# EAGLE design Breakout1v1 (EAGLE 9.0.1)
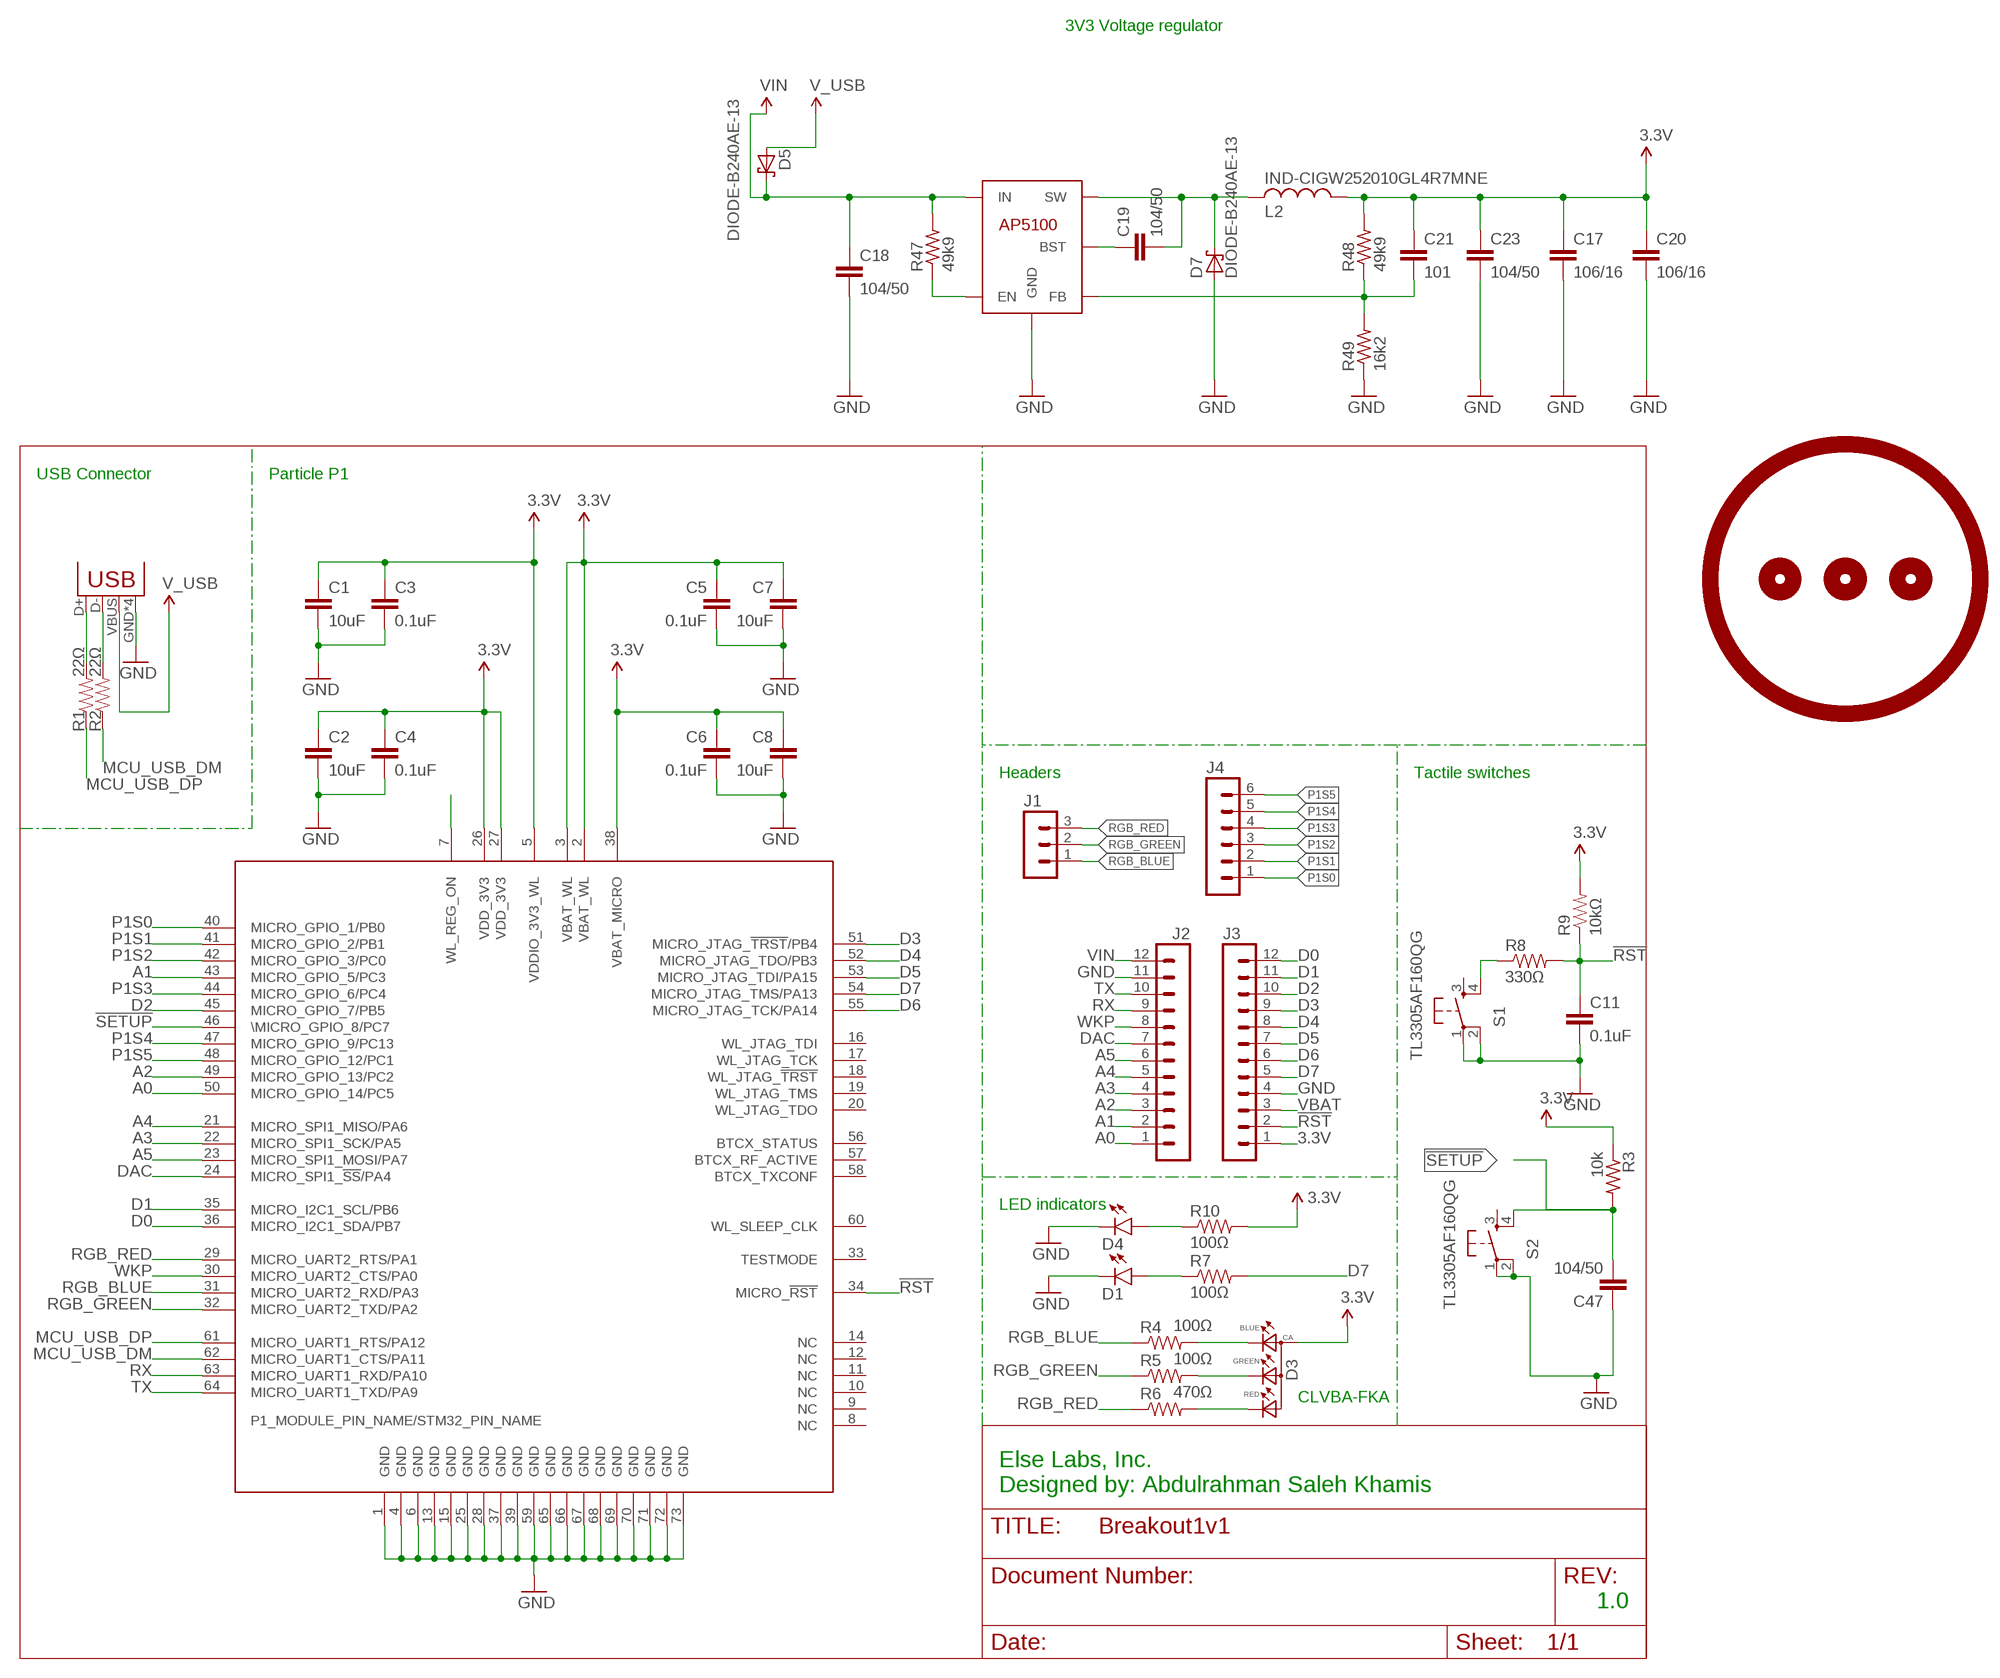
[diagram p0: schematic, sheet 1]

## Parts
C1  10uF  CAP0805  [0805]
C2  10uF  CAP0805  [0805]
C3  0.1uF  CAP0805  [0805]
C4  0.1uF  CAP0805  [0805]
C5  0.1uF  CAP0805  [0805]
C6  0.1uF  CAP0805  [0805]
C7  10uF  CAP0805  [0805]
C8  10uF  CAP0805  [0805]
C11  0.1uF  CAP0805  [0805]
C17  106/16  C-EUC0805  [C0805]
C18  104/50  C-EUC0603  [C0603]
C19  104/50  C-EUC0603  [C0603]
C20  106/16  C-EUC0805  [C0805]
C21  101  C-EUC0603  [C0603]
C23  104/50  C-EUC0603  [C0603]
C47  104/50  C-EUC0603  [C0603]
D1  LED0603  [LED-0603]
D3  CLVBA-FKAPLCC  [4-PLCC]
D4  LED0603  [LED-0603]
D5  DIODE-B240AE-13  [DO-214AC]
D7  DIODE-B240AE-13  [DO-214AC]
IC5  SMSP-BUCK-AP5100  [SOT23-6]
J1  MA03-1  [MA03-1]
J2  MA12-1  [MA12-1]
J3  MA12-1  [MA12-1]
J4  MA06-1  [MA06-1]
JP1  USBUSB-MICROB-SLOT-HOLE  [USB-MICROB-SLOT-HOLE]
L2  IND-CIGW252010GL4R7MNE  [L2520]
R1  22Ω  RESISTOR0805-RES  [0805]
R2  22Ω  RESISTOR0805-RES  [0805]
R3  10k  R-US_R0603  [R0603]
R4  100Ω  RESISTOR0805-RES  [0805]
R5  100Ω  RESISTOR0805-RES  [0805]
R6  470Ω  RESISTOR0805-RES  [0805]
R7  100Ω  RESISTOR0805-RES  [0805]
R8  330Ω  RESISTOR0805-RES  [0805]
R9  10kΩ  RESISTOR0805-RES  [0805]
R10  100Ω  RESISTOR0805-RES  [0805]
R47  49k9  R-US_R0603  [R0603]
R48  49k9  R-US_R0603  [R0603]
R49  16k2  R-US_R0603  [R0603]
S1  TL3305AF160QG  SWITCH-MOMENTARY-4.5MX4.5M  [TACTILE_SWITCH_SMD_4.5X4.5MM]
S2  TL3305AF160QG  SWITCH-MOMENTARY-4.5MX4.5M  [TACTILE_SWITCH_SMD_4.5X4.5MM]
U$1  LOGO  [LOGO]
UC1  P1  [WM-N-BM-14]

## Nets
3.3V: C1.1 C2.1 C3.1 C4.1 C5.1 C6.1 C7.1 C8.1 C17.1 C20.1 C21.1 C23.1 D3.2(ANODE) J3.1 L2.P$1 R3.1 R9.2 R10.2 R48.2 UC1.2(VBAT_WL) UC1.3(VBAT_WL) UC1.5(VDDIO_3V3_WL) UC1.26(VDD_3V3) UC1.27(VDD_3V3) UC1.38(VBAT_MICRO)
!RST: C11.1 J3.2 R8.2 R9.1 UC1.34(MICRO_!RST!)
!SETUP: C47.2 R3.2 S2.4 UC1.46(\MICRO_GPIO_8/PC7)
A0: J2.1 UC1.50(MICRO_GPIO_14/PC5)
A1: J2.2 UC1.43(MICRO_GPIO_5/PC3)
A2: J2.3 UC1.49(MICRO_GPIO_13/PC2)
A3: J2.4 UC1.22(MICRO_SPI1_SCK/PA5)
A4: J2.5 UC1.21(MICRO_SPI1_MISO/PA6)
A5: J2.6 UC1.23(MICRO_SPI1_MOSI/PA7)
BLR: D3.3(BLUE) R4.2
D0: J3.12 UC1.36(MICRO_I2C1_SDA/PB7)
D1: J3.11 UC1.35(MICRO_I2C1_SCL/PB6)
D2: J3.10 UC1.45(MICRO_GPIO_7/PB5)
D3: J3.9 UC1.51(MICRO_JTAG_!TRST!/PB4)
D4: J3.8 UC1.52(MICRO_JTAG_TDO/PB3)
D5: J3.7 UC1.53(MICRO_JTAG_TDI/PA15)
D6: J3.6 UC1.55(MICRO_JTAG_TCK/PA14)
D7: J3.5 R7.2 UC1.54(MICRO_JTAG_TMS/PA13)
DAC: J2.7 UC1.24(MICRO_SPI1_!SS!/PA4)
GND: C1.2 C2.2 C3.2 C4.2 C5.2 C6.2 C7.2 C8.2 C11.2 C17.2 C18.2 C20.2 C23.2 C47.1 D1.C D4.C D7.A IC5.2(GND) J2.11 J3.4 JP1.GND JP1.P$1(GND) JP1.P$2(GND) JP1.P$3(GND) R49.1 S1.1 S1.2 S2.1 S2.2 UC1.1(GND) UC1.4(GND) UC1.6(GND) UC1.13(GND) UC1.15(GND) UC1.25(GND) UC1.28(GND) UC1.37(GND) UC1.39(GND) UC1.59(GND) UC1.65(GND) UC1.66(GND) UC1.67(GND) UC1.68(GND) UC1.69(GND) UC1.70(GND) UC1.71(GND) UC1.72(GND) UC1.73(GND)
GRR: D3.4(GREEN) R5.2
MCU_USB_DM: R2.1 UC1.62(MICRO_UART1_CTS/PA11)
MCU_USB_DP: R1.1 UC1.61(MICRO_UART1_RTS/PA12)
N$2: JP1.D+ R1.2
N$3: JP1.D- R2.2
N$6: D1.A R7.1
N$7: R8.1 S1.4
N$9: D4.A R10.1
N$18: IC5.4(EN) R47.1
N$36: C19.1 IC5.1(BST)
N$37: C19.2 D7.C IC5.6(SW) L2.P$2
N$38: C21.2 IC5.3(FB) R48.1 R49.2
N$43: UC1.7(WL_REG_ON)
P1S0: J4.1 UC1.40(MICRO_GPIO_1/PB0)
P1S1: J4.2 UC1.41(MICRO_GPIO_2/PB1)
P1S2: J4.3 UC1.42(MICRO_GPIO_3/PC0)
P1S3: J4.4 UC1.44(MICRO_GPIO_6/PC4)
P1S4: J4.5 UC1.47(MICRO_GPIO_9/PC13)
P1S5: J4.6 UC1.48(MICRO_GPIO_12/PC1)
RER: D3.1(RED) R6.2
RGB_BLUE: J1.1 R4.1 UC1.31(MICRO_UART2_RXD/PA3)
RGB_GREEN: J1.2 R5.1 UC1.32(MICRO_UART2_TXD/PA2)
RGB_RED: J1.3 R6.1 UC1.29(MICRO_UART2_RTS/PA1)
RX: J2.9 UC1.63(MICRO_UART1_RXD/PA10)
TX: J2.10 UC1.64(MICRO_UART1_TXD/PA9)
V_USB: D5.A JP1.VBUS
VBAT: J3.3
VIN: C18.1 D5.C IC5.5(IN) J2.12 R47.2
WKP: J2.8 UC1.30(MICRO_UART2_CTS/PA0)
Unconnected: S1.3 S2.3 UC1.8(NC) UC1.9(NC) UC1.10(NC) UC1.11(NC) UC1.12(NC) UC1.14(NC) UC1.16(WL_JTAG_TDI) UC1.17(WL_JTAG_TCK) UC1.18(WL_JTAG_!TRST!) UC1.19(WL_JTAG_TMS) UC1.20(WL_JTAG_TDO) UC1.33(TESTMODE) UC1.56(BTCX_STATUS) UC1.57(BTCX_RF_ACTIVE) UC1.58(BTCX_TXCONF) UC1.60(WL_SLEEP_CLK)

## Notes on the sheet
- 3V3 Voltage regulator
- USB Connector | Particle P1
- Headers | Tactile switches
- LED indicators
- CLVBA-FKA
- Else Labs, Inc.
  Designed by: Abdulrahman Saleh Khamis
- 1.0

## Library data of the parts
C1-C8 C11 = SparkFun-Capacitors:CAP: Capacitor Standard 0603 ceramic capacitor, and 0.1" leaded capacitor.
C17-C21 C23 C47 = rcl:C-EU: CAPACITOR, European symbol; SPICEPREFIX: C
D1 D4 = SparkFun-LED:LED: LEDs Standard schematic elements and footprints for 5mm, 3mm, 1206, and 0603 sized LEDs. 5mm - Spark Fun Electronics SKU : COM-00529 (and others)
D3 = ElseLabs:CLVBA-FKA: Everlight Red/Green/Blue LED 67-23/R6GHBHC-B01/2T || 67-23/R6GHBH-B01 Size 3.2*2.8*1.9mm Mounting Type SMD Full-Color LED PLCC4 Emitting Color Red/Green/Blue (620-625/530-535/470-475 nm) Chip Material AlGaInP/InGaN/InGaN Luminous Intensity 57-112/225-450/36-72 mcd Viewing Angle 120 deg Lens Type-Color Water Clear Forward Voltage 2.0/3.5/3.5 V Forward Current 10 mA Maximum Forward Voltage 2.4/3.9/3.9 V Maximum Forward Current 25/25/25 mA Min-Max Operating Temperature -40C to +85C Factory Pack 2000 pcs-Reel RoHS ✓; PROD_ID: DIO-12986
D5 D7 = TAHI EagleCAD part library:DIODE-B240AE-13
IC5 = TAHI EagleCAD part library:SMSP-BUCK-AP5100
J1 = con-lstb:MA03-1: PIN HEADER; OC_FARNELL: unknown; OC_NEWARK: unknown
J2 J3 = con-lstb:MA12-1: PIN HEADER; OC_FARNELL: unknown; OC_NEWARK: unknown
J4 = con-lstb:MA06-1: PIN HEADER; OC_FARNELL: unknown; OC_NEWARK: unknown
JP1 = ElseLabs:USB
L2 = TAHI EagleCAD part library:IND-CIGW252010GL4R7MNE
R1 R2 R4-R10 = SparkFun-Resistors:RESISTOR: Resistor Basic schematic elements and footprints for 0603, 1206, and PTH resistors.
R3 R47-R49 = rcl:R-US_: RESISTOR, American symbol; SPICEPREFIX: R
S1 S2 = ElseLabs:SWITCH-MOMENTARY
U$1 = ElseLabs:LOGO
UC1 = Particle-Devices:P1: Particle P1 module (WiFi with antenna)

## Net classes
1 P1: width 0.254 mm, drill 0.35 mm, clearance 0.178 mm

## Board
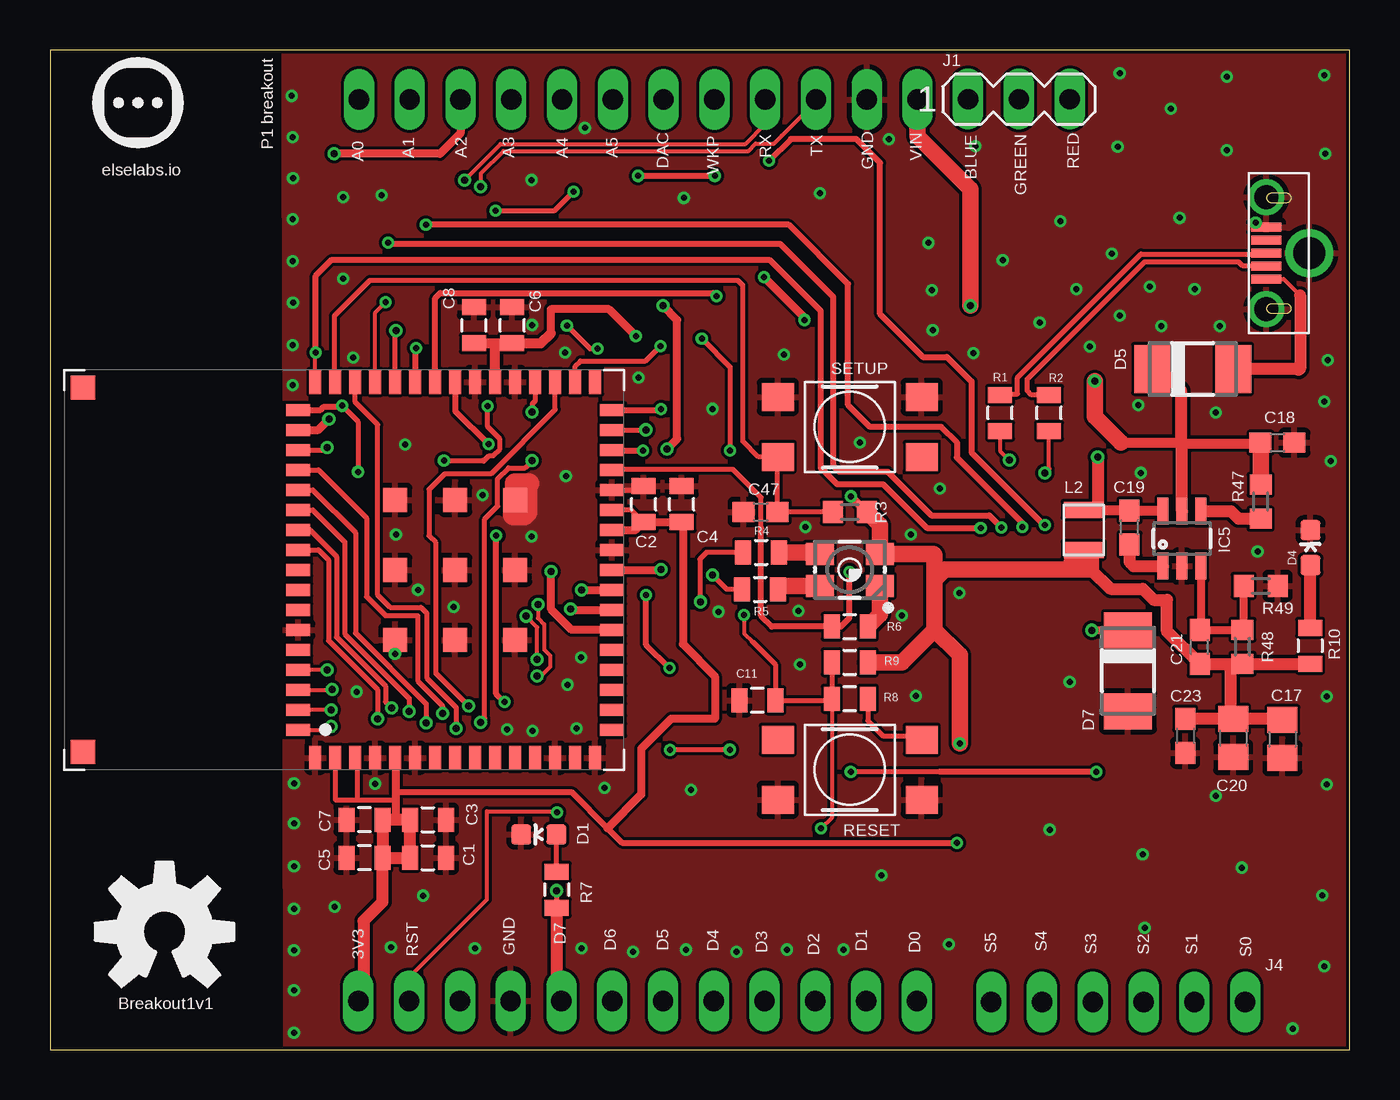
[diagram p1: board, top side]
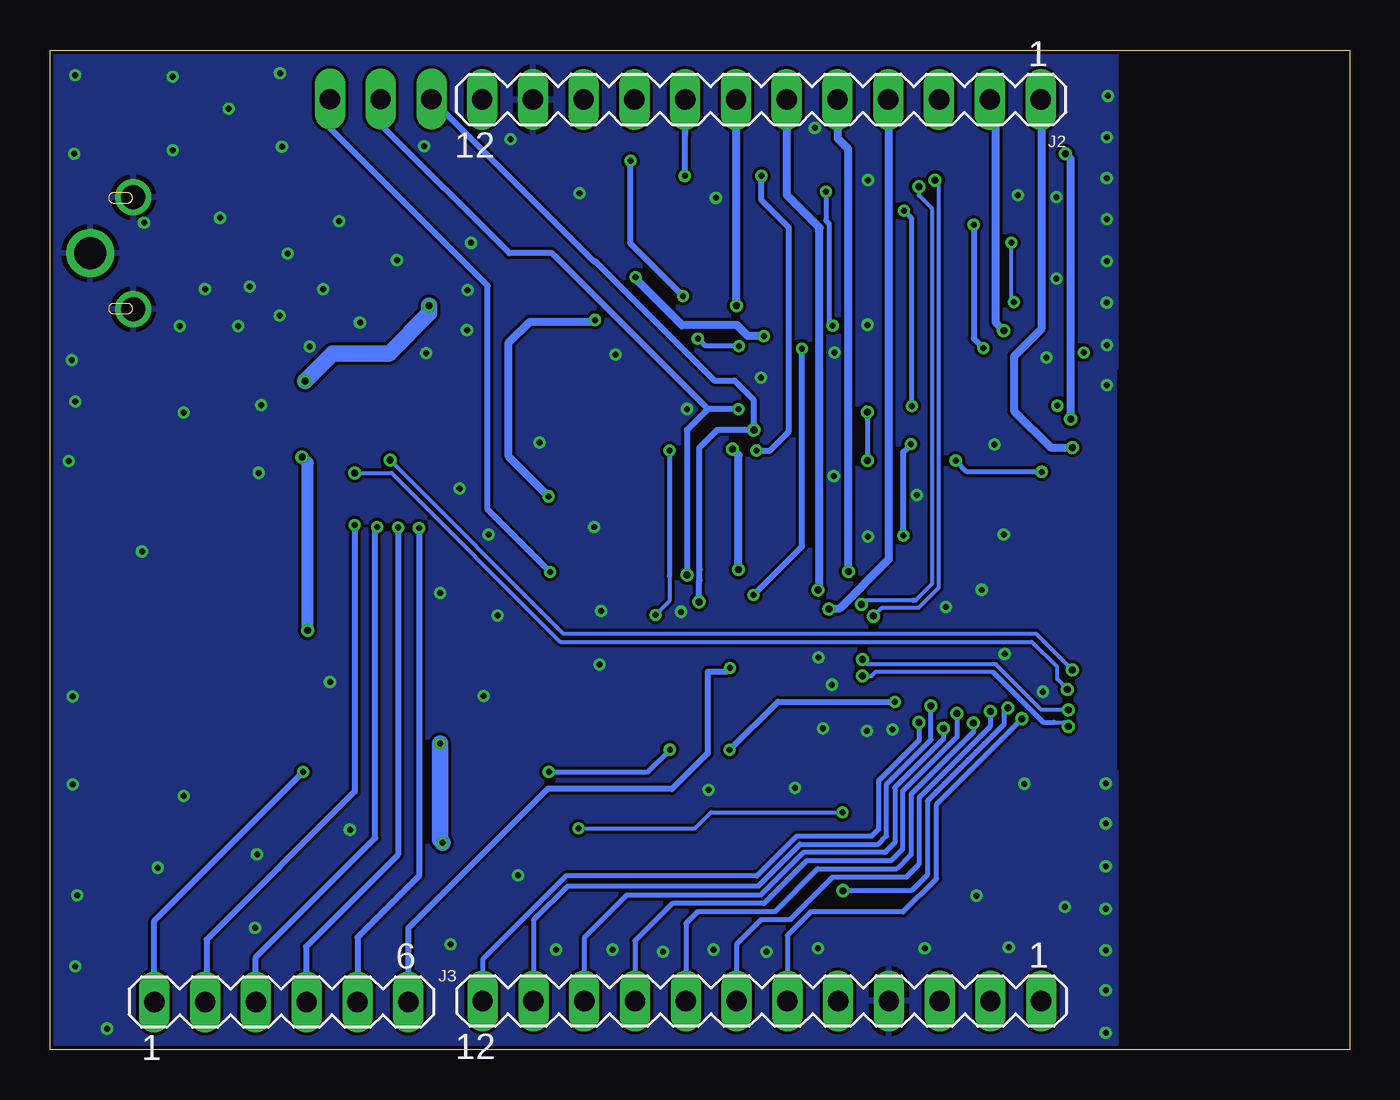
[diagram p2: board, bottom side, seen from below]

Size 65 x 50 mm. Coordinates in mm from the lower left corner, seen from the top.
Outline: 0,0 65,0 65,50 0,50 0,0
Copper layers (1*16): Top 0.035mm / dielectric 1.5mm / Bottom 0.035mm
Design rules "PCBway *": minimum track width 6mil, minimum drill 0.3mm, track to track 6mil, track to pad 6mil, pad to pad 6mil, via to via 6mil, smd to smd 0mil, copper to edge 7mil, drill to drill 6mil, minimum pad ring 6mil, minimum via ring 6mil, stop-mask expansion 2mil, vias tented up to drill 25mil, thermal gap 10mil

### Footprints (pad centres in the part's own frame; a part is rotated, then mirrored left to right if it is on the bottom)
0805 = smd 0.8 x 1.2: 1 -0.9,0; 2 0.9,0
C0805 = smd 1.3 x 1.5: 1 -0.95,0; 2 0.95,0
C0603 = smd 1.1 x 1: 1 -0.85,0; 2 0.85,0
LED-0603 = smd 1 x 1: A 0,-0.877; C 0,0.877
4-PLCC = smd 1.4 x 1.1: 1 -1.5,0.8; 2 -1.5,-0.8; 3 1.5,-0.8; 4 1.5,0.8
DO-214AC = smd 1.8 x 2.4: A 2.025,0; C -2.025,0
SOT23-6 = smd 0.55 x 1.35: 1 -0.95,-1.375; 2 0,-1.375; 3 0.95,-1.375; 4 0.95,1.375; 5 0,1.375; 6 -0.95,1.375
MA03-1 = drill 1.016 long: 1 -2.54,0; 2 0,0; 3 2.54,0
MA12-1 = drill 1.016 long: 1 -13.97,0; 2 -11.43,0; 3 -8.89,0; 4 -6.35,0; 5 -3.81,0; 6 -1.27,0; 7 1.27,0; 8 3.81,0; 9 6.35,0; 10 8.89,0; 11 11.43,0; 12 13.97,0
MA06-1 = drill 1.016 long: 1 -6.35,0; 2 -3.81,0; 3 -1.27,0; 4 1.27,0; 5 3.81,0; 6 6.35,0
USB-MICROB-SLOT-HOLE = smd 0.45 x 1.5: D+ 0,0.635; D- -0.65,0.635; GND 1.3,0.635; ID 0.65,0.635; VBUS -1.3,0.635 | drill 1.2: P$1 2.8,0.635; P$2 -2.8,0.635 | drill 1.6: P$3 0,-1.515
L2520 = smd 0.8 x 2: P$1 -1,0; P$2 1,0
R0603 = smd 1 x 1.1: 1 -0.85,0; 2 0.85,0
TACTILE_SWITCH_SMD_4.5X4.5MM = smd 1.6 x 1.4: 1 -3.6,-1.5; 2 3.6,-1.5; 3 -3.6,1.5; 4 3.6,1.5
WM-N-BM-14 = smd 1.2 x 0.6: 1 0.6,15.45; 2 0.6,14.45; 3 0.6,13.45; 4 0.6,12.45; 5 0.6,11.45; 6 0.6,10.45; 7 0.6,9.45; 8 0.6,8.45; 9 0.6,7.45; 10 0.6,6.45; 11 0.6,5.45; 12 0.6,4.45; 13 0.6,3.45; 14 0.6,2.45; 15 0.6,1.45; 33 19.4,1.45; 34 19.4,2.45; 35 19.4,3.45; 36 19.4,4.45; 37 19.4,5.45; 38 19.4,6.45; 39 19.4,7.45; 40 19.4,8.45; 41 19.4,9.45; 42 19.4,10.45; 43 19.4,11.45; 44 19.4,12.45; 45 19.4,13.45; 46 19.4,14.45; 47 19.4,15.45 | smd 0.6 x 1.2: 16 2,0.6; 17 3,0.6; 18 4,0.6; 19 5,0.6; 20 6,0.6; 21 7,0.6; 22 8,0.6; 23 9,0.6; 24 10,0.6; 25 11,0.6; 26 12,0.6; 27 13,0.6; 28 14,0.6; 29 15,0.6; 30 16,0.6; 31 17,0.6; 32 18,0.6; 48 18,16.3; 49 17,16.3; 50 16,16.3; 51 15,16.3; 52 14,16.3; 53 13,16.3; 54 12,16.3; 55 11,16.3; 56 10,16.3; 57 9,16.3; 58 8,16.3; 59 7,16.3; 60 6,16.3; 61 5,16.3; 62 4,16.3; 63 3,16.3; 64 2,16.3 | smd 1.2 x 1.2: 65 6.5,11.45; 66 6.5,8.45; 67 6.5,5.45; 68 10,11.45; 69 10,8.45; 70 10,5.45; 71 13.5,11.45; 72 13.5,8.45; 73 13.5,5.45; 74 19.12,27.07; 75 0.88,27.07

### Placement (x,y rotation side)
C1  18.91,9.6 0 top
C2  29.69,27.28 90 top
C3  18.91,11.5 0 top
C4  31.59,27.28 90 top
C5  15.73,9.6 180 top
C6  23.11,36.23 90 top
C7  15.73,11.5 180 top
C8  21.21,36.23 90 top
C11  35.38,17.46 180 top
C17  61.64,15.53 270 top
C18  61.39,30.36 0 top
C19  54,26.12 90 top
C20  59.18,15.58 270 top
C21  57.51,20.13 90 top
C23  56.78,15.69 270 top
C47  35.55,26.89 0 top
D1  24.45,10.76 90 top
D3  40,24 180 top
D4  63.04,25.11 0 top
D5  57.15,34.04 0 top
D7  53.92,18.95 270 top
IC5  56.62,25.56 0 top
J1  48.46,47.54 0 top
J2  29.42,47.52 180 bottom
J3  29.39,2.43 180 bottom
J4  53.43,2.38 0 bottom
JP1  61.47,39.84 90 top
L2  51.71,26 90 top
R1  47.52,31.85 90 top
R2  49.97,31.85 90 top
R3  40,26.89 180 top
R4  35.57,24.87 0 top
R5  35.52,23.01 0 top
R6  40,21.16 0 top
R7  25.34,7.99 270 top
R8  40,17.55 180 top
R9  40,19.36 0 top
R10  63.03,20.19 270 top
R47  60.56,27.41 90 top
R48  59.64,20.15 270 top
R49  60.56,23.19 180 top
S1  40,14 0 top
S2  40,31.14 180 top
U$1  2.13,45.09 0 top
U$3  [OSHW-LOGO-L]  5.73,5.89 0 top
UC1  28.72,14 90 top

### Tracks (layer width: path | path; a pad name or v marks a point on that pad's centre or on a via)
3.3V  (via drill 0.3)
  Top 0.254: UC1.2 14.27,12.49 15.38,12.49 | 15.38,12.49 17.24,12.49 17.3,12.43 | 15.38,12.49 15.38,14.49 UC1.3 | C2.1 29.07,27 UC1.27 | J3.1 15.68,2.69 15.68,3.22
  Top 0.305: 17.3,12.99 17.41,12.88 26.08,12.88 27.89,11.07 28.62,10.34 v45.36,10.34 | C23.1 C20.1
  Top 0.406: C7.1 17.3,11.5 | 17.3,11.5 C3.1 | 17.3,11.5 17.3,12.43 17.3,12.99 17.3,14.57 UC1.5 | 22.31,33.44 UC1.38 | UC1.26 29.31,26 C2.1 C4.1 31.65,26.32 31.65,20.28 33.26,18.67 33.26,16.55 31.07,16.55 29.57,15.05 29.57,12.76 27.89,11.07 | v29.3,35.69 27.96,37.03 25.05,37.03 25.05,35.82 | v35.71,38.63 37.73,36.61 v37.73,36.5 | v40.06,27.67 R3.1
  Top 0.508: 25.05,35.82 24.56,35.33 C6.1 22.27,35.33 | C8.1 22.27,35.33 | UC1.38 22.27,35.33
  Top 0.61: C17.1 61.58,16.54 C23.1 | 59.06,19.28 C21.1 55.87,20.91 55.87,22.49 55.21,22.49 54.66,23.04 53.05,23.04 52.06,24.02 | 59.06,19.28 59.62,19.28 R48.2 R10.2 | C20.1 59.06,16.66 59.06,19.28 | C5.1 16.64,7.38 15.68,6.43 15.68,3.22 15.68,2.71 | C5.1 C1.1 C3.1 C7.1 C5.1
  Top 0.813: R3.1 41.5,26.24 D3.2 44.18,24.8 44.24,24.74 44.24,23.5 | 44.24,20.99 44.24,23.5 | R9.2 42.62,19.36 44.24,20.99 | 44.24,20.99 45.5,19.73 v45.5,15.32 | 44.24,23.5 44.77,24.02 51.11,24.02 | 51.11,24.02 52.06,24.02 52.06,24.64 L2.P$1 51.11,24.4 51.11,24.02
  Bottom 0.406: v29.3,35.69 30.1,35.69 30.64,36.23 33.39,36.23 35.75,38.59 v35.71,38.63 | v40.06,27.67 42.06,29.67 42.06,35.35 41,36.41 37.82,36.41 v37.73,36.5
  Bottom 0.813: v45.5,15.32 45.5,10.48 v45.36,10.34
!RST  (via drill 0.3)
  Top 0.2: v25.36,11.87 25.31,11.92 21.86,11.92 21.86,7.51 17.98,3.63 17.96,3.61 | R8.2 39.1,11.6 v38.56,11.06 | v34.72,21.73 34.72,20.82 35.13,20.41
  Top 0.254: R9.1 R8.2 39.02,17.46 C11.1 36.28,19.26 35.13,20.41 | UC1.34 26.27,34.18 26.53,34.44 29.78,34.44 v30.53,35.19 | v32.6,35.57 34.02,34.15 v34.02,29.96 | J3.2 17.98,2.45 17.98,3.63
  Bottom 0.2: v25.36,11.87 31.93,11.87 32.74,11.06 v38.56,11.06 | 34.02,23.67 34.02,22.43 v34.72,21.73
  Bottom 0.254: v30.53,35.19 32.22,35.19 v32.6,35.57 | v34.02,29.96 34.02,23.67
!SETUP
  Top 0.254: R3.2 C47.2 S2.4 35.44,29.64 34.65,30.43 34.65,38.22 34.39,38.48 16.01,38.48 14.23,36.7 14.23,33.44 UC1.46
A0  (via drill 0.35)
  Top 0.254: UC1.50 13.74,30 v13.86,30.12
  Bottom 0.406: v13.86,30.12 14.95,30.12 16.78,31.95 16.78,34.67 15.42,36.03 15.42,47.49 J2.1
A1  (via drill 0.35)
  Top 0.254: UC1.43 17.27,35.94 v17.3,35.97
  Bottom 0.406: v17.3,35.97 17.68,36.35 17.68,47.21 J2.2
A2  (via drill 0.35)
  Top 0.406: UC1.49 13.42,31 v13.95,31.53 | v14.21,44.81 19.51,44.81 20.53,45.83 J2.3
  Bottom 0.406: v13.95,31.53 13.95,44.55 v14.21,44.81
A3  (via drill 0.35)
  Top 0.406: v26.03,22.03 26.06,22 UC1.22
  Bottom 0.406: v26.03,22.03 25.99,22.07 25.5,22.07 23.04,24.53 23.04,47.49 J2.4
A4  (via drill 0.35)
  Top 0.406: UC1.21 26.09,21 25.07,22.02 v25.07,23.92
  Bottom 0.406: v25.07,23.92 25.07,45.05 25.59,45.57 25.59,47.5 J2.5
A5  (via drill 0.35)
  Top 0.406: v26.59,22.99 UC1.23
  Bottom 0.406: v26.59,22.99 26.51,23.07 26.51,41.11 28.15,42.75 J2.6
BLR
  Top 0.813: R4.2 38.43,24.87 D3.3
D0  (via drill 0.35)
  Top 0.254: UC1.36 24.27,32.44 24.12,32.29 v24.12,31.89 | v21.54,16.37 21.74,16.57 21.74,26.54 22.39,27.19 22.39,28.56 22.93,29.1 23.75,29.1 v24.12,29.47
  Bottom 0.254: v21.54,16.37 21.54,15.46 23.56,13.44 23.56,11.01 23.9,10.67 27.65,10.67 29.65,8.68 39.19,8.68 43.36,4.51 J3.12 | v24.12,31.89 v24.12,29.47
D1  (via drill 0.35)
  Top 0.254: v20.93,17.18 19.3,18.81 19.3,25.36 18.96,25.7 18.96,28.02 19.74,28.8 22.05,28.8 25.27,32.02 UC1.35
  Bottom 0.254: v20.93,17.18 20.93,15.49 23.15,13.27 23.15,10.68 23.57,10.26 27.49,10.26 29.58,8.17 39.12,8.17 40.82,6.47 J3.11
D2  (via drill 0.35)
  Top 0.254: v20.32,16.07 20.32,17.11 18.84,18.59 18.84,21.84 18.56,22.12 17.02,22.12 16.39,22.75 16.39,31.26 15.27,32.38 UC1.45
  Bottom 0.254: v20.32,16.07 20.32,15.53 22.75,13.1 22.75,10.35 23.24,9.86 27.32,9.86 29.46,7.71 36.16,7.71 38.28,5.59 J3.10
D3  (via drill 0.35)
  Top 0.254: v19.63,16.81 19.63,17.2 18.39,18.44 18.39,21.71 16.78,21.71 15.83,22.66 15.83,26.6 13.43,29 UC1.51
  Bottom 0.254: v19.63,16.81 19.63,15.64 22.34,12.94 22.34,10.03 22.92,9.45 27.15,9.45 29.29,7.31 33.87,7.31 35.74,5.44 J3.9
D4  (via drill 0.35)
  Top 0.254: v18.82,16.34 18.82,17.29 15.28,20.83 15.28,25.86 13.14,28 UC1.52
  Bottom 0.254: v18.82,16.34 18.82,15.88 21.93,12.77 21.93,9.75 22.64,9.04 26.61,9.04 28.75,6.9 32.61,6.9 33.2,6.31 J3.8
D5  (via drill 0.35)
  Top 0.254: v17.97,16.92 17.97,17.57 14.74,20.8 14.74,25.4 13.14,27 UC1.53
  Bottom 0.254: v17.97,16.92 17.97,16.16 21.53,12.6 21.53,9.27 22.16,8.64 25.85,8.64 27.99,6.49 29.44,6.49 30.66,5.27 J3.7
D6  (via drill 0.35)
  Top 0.254: UC1.55 13.43,25 13.93,24.5 13.93,20.46 16.38,18.01 v16.38,16.55
  Bottom 0.254: v16.38,16.55 20.66,12.27 20.66,8.55 22.33,6.88 26.95,6.88 28.12,5.71 J3.6
D7  (via drill 0.35)
  Top 0.254: v17.09,17.09 16.79,17.39 16.79,18.18 14.34,20.63 14.34,24.67 13.01,26 UC1.54 | v25.33,7.95 25.34,7.93 R7.2 25.34,2.67 J3.5
  Top 0.61: R7.2 25.34,2.69
  Bottom 0.254: v17.09,17.09 17.28,16.9 17.28,16.27 21.12,12.43 21.12,8.75 21.92,7.95 v25.33,7.95
DAC  (via drill 0.35)
  Top 0.406: UC1.24 v30.55,24 v30.56,24.01 | v30.87,30.04 31.37,30.54 31.37,36.5 v30.66,37.21
  Bottom 0.406: v30.56,24.01 30.56,29.73 v30.87,30.04 | v30.66,37.21 30.66,47.49 J2.7
GND  (via drill 0.3)
  Top 0.254: UC1.28 29.51,28 C2.2
  Top 1.016: UC1.73 23.27,28.31 | 23.27,28.31 23.26,28.31 | 23.27,28.31 23.95,28.31 23.87,28.23 23.87,26.87 23.74,26.74 23.16,26.74
  other vias: 12.13,33.24 12.13,35.24 12.15,37.37 12.13,39.44 12.13,41.53 12.15,43.58 12.13,45.63 12.09,47.7 16.58,42.73 17.76,30.26 25.8,28.69 24.09,25.67 20.18,22.13 18.4,23 17.3,25.76 24.14,15.94 22.86,16.02 26.34,16.07 25.89,18.25 26.57,19.61 27.74,13.09 16.26,13.3 12.2,13.31 12.2,11.31 12.2,9.17 12.2,7.03 14.24,7.13 12.2,4.96 18.66,7.7 17.05,5.11 12.2,2.97 12.2,0.83 21.25,5.06 26.59,5.06 29.17,4.88 31.81,5 34.34,4.88 36.86,5 39.68,5 41.58,8.71 32.06,12.99 44.97,5.27 59.61,9.1 58.32,12.69 63.87,13.26 63.63,7.71 63.73,4.16 62.15,1.05 63.87,17.67 60.4,24.91 64.07,29.43 63.74,32.41 63.91,34.48 57.25,38.04 55.01,38.16 53.52,36.72 52.02,35.17 49.5,36.37 51.33,38.04 53.11,39.82 50.53,41.43 56.5,41.6 46.28,45.19 53.4,45.17 58.86,44.99 63.79,44.82 53.5,48.83 56.06,47.06 58.86,48.67 63.74,48.73 43.94,40.35 44.12,37.98 44.15,35.99 46.18,34.83 14.67,38.57 15.17,34.61 14.67,42.64 29.43,33.62 24.09,43.5 26.75,46.1 44.52,28.06 40.51,30.36 42.61,21.71 37.51,19.27 36.71,34.76 37.43,21.93 54.56,28.85 31.7,42.6 45.48,22.83 51,18.38 43.32,17.68 50,11 54.75,6.08 54.65,9.77 41.96,45.53 33.14,32.05 15.34,17.9 17.25,19.78 24.11,36.25 25.77,34.86 54.43,32.24 60.3,41.37 58.31,31.87 37.79,26.13 43.06,25.76 21.64,27.73 33.43,21.9 47.65,39.49 38.51,42.84 55.58,36.19 58.51,36.19
  pour Top: 11.79,-0.34 65.13,-0.34 65.13,49.99 11.72,49.99
  pour Top: 11.79,-0.34 65.13,-0.34 65.13,49.99 11.72,49.99
  pour Bottom: 65.02,-0.54 11.68,-0.54 11.68,49.79 65.09,49.79
GRR
  Top 0.813: R5.2 36.61,23.2 D3.4
MCU_USB_DM  (via drill 0.35)
  Top 0.2: UC1.62 14.09,18 | 49.97,29.04 R2.1
  Top 0.254: 14.09,18 v14.11,18.02 | v49.77,28.84 49.97,29.04
  Bottom 0.2: v49.77,28.84 47.92,28.84 39.48,20.4 15.89,20.4 14.62,19.13 14.62,18.53 v14.11,18.02
MCU_USB_DP  (via drill 0.35)
  Top 0.2: R1.1 47.52,29.95 v47.99,29.48 | v13.86,18.99 UC1.61
  Top 0.254: 12.52,19.1 UC1.61
  Bottom 0.2: v47.99,29.48 39.31,20.8 15.67,20.8 v13.86,18.99
N$2
  Top 0.254: R1.2 47.56,32.79 48.39,32.79 48.39,33.62 54.57,39.8 60.8,39.8 JP1.D+
N$3
  Top 0.254: R2.2 49.09,32.75 48.88,32.96 48.88,33.54 54.74,39.39 59.46,39.39 59.66,39.19 JP1.D-
N$6
  Top 0.254: R7.1 25.34,10.74 D1.A
N$7
  Top 0.254: R8.1 40.9,16.45 41.66,15.69 43.41,15.69 S1.4
N$9
  Top 0.61: R10.1 D4.A
N$18
  Top 0.61: R47.1 59.44,26.56 59.06,26.93 IC5.4
N$36
  Top 0.61: C19.1 53.99,24.39 54.21,24.18 IC5.1
N$37  (via drill 0.35)
  Top 0.406: D7.C v52.11,20.98
  Top 0.508: IC5.6 54.03,26.93 C19.2 53.97,27 L2.P$2
  Top 0.61: L2.P$2 51.77,26.93 52.3,26.93 52.4,27.04 v52.4,29.63
  Bottom 0.61: v52.11,20.98 52.11,29.34 v52.4,29.63
N$38
  Top 0.406: IC5.3 57.57,21.04 C21.2 57.52,21 R48.1 59.71,21.07 R49.2
P1S0  (via drill 0.3)
  Top 0.254: 44.5,13.89 v40.05,13.89 | v34,15 31.03,15 v31.01,14.98
  Top 0.305: 20.27,32.59 UC1.40 20.27,31.95 v21.93,30.29 | v52.34,13.89 44.5,13.89 | v22.73,17.39 22.32,17.8 v22.32,25.72
  Bottom 0.254: v40.05,13.89 35.11,13.89 v34,15
  Bottom 0.305: J4.1 59.78,6.45 v52.34,13.89 | v31.01,14.98 28.6,17.39 v22.73,17.39 | v22.32,25.72 22.32,29.9 v21.93,30.29
P1S1  (via drill 0.3)
  Top 0.305: UC1.41 19.27,37.59 19.52,37.84 33.17,37.84 v33.33,37.68 | v35.96,44.46 37.05,45.55 40.33,45.55 41.52,44.36 41.52,36.79 43.66,34.65 44.86,34.65 46.09,33.42 46.09,29.87 49.72,26.24 v49.76,26.24
  Bottom 0.305: v33.33,37.68 35.96,40.31 v35.96,44.46 | v49.76,26.24 49.76,12.91 57.17,5.5 57.17,2.45 J4.2
P1S2  (via drill 0.3)
  Top 0.305: v18.8,41.26 36.96,41.26 39.92,38.3 39.92,32.25 41.02,31.15 44.58,31.15 45.35,30.38 45.35,29.62 48.64,26.33 v48.64,26.14 | v18.32,35.09 18.27,35.04 UC1.42
  Bottom 0.305: J4.3 54.7,4.61 48.73,10.58 48.73,26.05 v48.64,26.14 | v18.8,41.26 18.8,35.57 v18.32,35.09
P1S3  (via drill 0.3)
  Top 0.2: UC1.44 16.27,36.87 v16.78,37.38
  Top 0.305: v16.92,40.37 16.98,40.31 36.52,40.31 39.17,37.66 39.17,29.21 39.47,28.91 41.89,28.91 44.08,26.72 46.98,26.72 v47.59,26.11
  Bottom 0.2: v16.78,37.38 16.92,37.52 v16.92,40.37
  Bottom 0.305: v47.59,26.11 47.59,9.75 52.19,5.15 52.19,2.41 J4.4
P1S4  (via drill 0.3)
  Top 0.2: UC1.47 13.27,34.85 v13.29,34.87
  Top 0.305: v13.29,34.87 13.29,38.71 14.09,39.51 35.98,39.51 38.54,36.95 38.54,29.11 39.37,28.28 41.66,28.28 43.85,26.09 v46.55,26.09
  Bottom 0.305: v46.55,26.09 46.55,8.68 49.62,5.61 J4.5
P1S5  (via drill 0.3)
  Top 0.254: v14.61,32.2 15.4,31.41 v15.4,28.9 | v19.7,29.47 21.65,29.47 21.69,29.43 21.97,29.71 22.17,29.71 22.51,30.05 22.51,30.53 21.89,31.15 v21.89,32.19 | v22.29,41.97 25.24,41.97 v26.19,42.92 | v25.85,36.22 27.01,35.06 v27.38,35.06
  Top 0.305: UC1.48 13.53,32 13.69,32.16 14.21,32.16 14.49,32.16 14.53,32.2 v14.61,32.2 | v30.98,19.08 29.82,20.24 v29.82,22.73
  Bottom 0.254: v15.4,28.9 19.13,28.9 v19.7,29.47 | v21.89,32.19 21.89,41.57 v22.29,41.97 | v26.19,42.92 26.19,41.47 26.03,41.31 26.03,36.4 v25.85,36.22
  Bottom 0.305: v30.98,19.08 31.15,18.91 32.11,18.91 32.11,14.81 33.89,13.03 40.12,13.03 47.08,6.07 J4.6 | v29.82,22.73 27.38,25.17 v27.38,35.06
RER
  Top 0.813: R6.2 41.5,21.76 D3.1
RGB_BLUE  (via drill 0.35)
  Top 0.254: R4.1 32.84,24.87 32.5,24.53 32.5,22.43 v32.53,22.4 | UC1.31 v29.8,31
  Bottom 0.305: v32.53,22.4 32.53,23.45 32.51,23.47 32.51,23.99 32.53,24.01 32.53,30.1 31.63,31 30.94,31 29.87,31 | 29.87,31 29.82,31.05 29.82,32.52 30.77,33.47 31.77,33.47 37.72,39.42 37.8,39.42 J1.1 | 29.87,31 v29.8,31
RGB_GREEN  (via drill 0.3, 0.35)
  Top 0.254: R5.1 33.86,23.01 v33.14,23.73
  Top 0.305: UC1.32 30.52,32 v30.56,32.04
  Bottom 0.305: v33.14,23.73 33.14,30.99 32.09,32.04 | v30.56,32.04 32.09,32.04 | 32.09,32.04 39.88,39.83 42.02,39.83 48.46,46.27 J1.2
RGB_RED  (via drill 0.3)
  Top 0.254: 35.57,26.08 35.57,27.61 34.16,29.02 28.14,29.02 UC1.29
  Top 0.305: 35.57,26.08 35.57,21.7 36.11,21.16 R6.1 39.56,21.16 39.98,21.58 v39.98,23.88
  Bottom 0.305: J1.3 51,46.09 43.11,38.2 43.11,27.01 v39.98,23.88
RX  (via drill 0.35)
  Top 0.2: v14.06,17 UC1.63 | v24.37,19.52 24.37,21.12 v23.82,21.68 | v20.73,43.5 22.53,45.3 34.78,45.3 35.74,46.26
  Top 0.406: J2.9 35.74,47.49 35.74,46.26
  Bottom 0.2: v14.06,17 15.41,17 17.68,19.26 24.12,19.26 v24.37,19.52 | v23.82,21.68 23.39,22.11 21.54,22.11 20.55,23.1 20.55,43.31 v20.73,43.5
TX  (via drill 0.35)
  Top 0.2: v21.55,43.16 21.55,43.81 22.68,44.95 34.93,44.95 35.3,45.32 36.21,45.32 36.6,45.72 | v24.4,22.26 24.4,21.59 24.72,21.27 24.72,20 25.03,19.7 25.03,19.16 24.55,18.68 v24.37,18.68
  Top 0.203: UC1.64 13.9,16 v14.06,16.16 | 36.6,45.72 38.31,47.42
  Top 0.406: 38.31,47.42 J2.10
  Bottom 0.2: v21.55,43.16 21.55,42.73 20.9,42.08 20.9,23.29 21.7,22.49 | v24.4,22.26 24.18,22.49 21.84,22.49 | v24.37,18.68 23.91,18.68 23.68,18.91 17.87,18.91 17.84,18.88
  Bottom 0.203: 14.77,16.36 14.26,16.36 v14.06,16.16
  Bottom 0.254: 14.77,16.36 15.32,16.36 17.84,18.88 | 21.84,22.49 21.7,22.49
V_USB
  Top 0.2: JP1.VBUS 61.7,38.54 62.52,37.72 62.66,37.58
  Top 0.61: 62.52,37.72 62.52,34.05 62.46,33.99 62.41,34.04 D5.A
VIN  (via drill 0.35)
  Top 0.508: 53.56,30.35 56.59,30.35 56.62,30.32 60.52,30.32 60.55,30.35
  Top 0.61: D5.C 55.4,34.15 56.59,32.96 56.59,30.35 | IC5.5 56.62,30.32
  Top 0.813: R47.2 60.55,30.35 C18.1 | v52.25,33.44 52.25,31.66 53.56,30.35 | v46.04,37.2 46.04,43.04 43.39,45.69 J2.12
  Bottom 0.813: v52.25,33.44 50.87,34.82 48.05,34.82 46.04,36.83 v46.04,37.2
WKP  (via drill 0.3)
  Top 0.305: UC1.30 28.15,29.97 v29.66,29.97 | v29.42,43.7 v33.25,43.7
  Bottom 0.305: v29.66,29.97 28.99,29.97 28.04,30.92 28.04,41.12 29.42,42.5 v29.42,43.7 | v33.25,43.7 33.25,45.71 | 33.25,45.71 33.25,47.95 | J2.8 33.23,45.73 33.25,45.71

### Text on the board
tPlace: SETUP | RESET
tNames: P1 breakout | A1 | A2 | A3 | A4 | A5 | RX | TX | elselabs.io | A0 | DAC | WKP | GND | VIN | BLUE | RED | GREEN | 3V3 | RST | GND | D7 | D6 | D5 | D4 | D3 | D2 | D1 | D0 | S5 | S4 | S3 | S2 | S1 | S0 | Breakout1v1